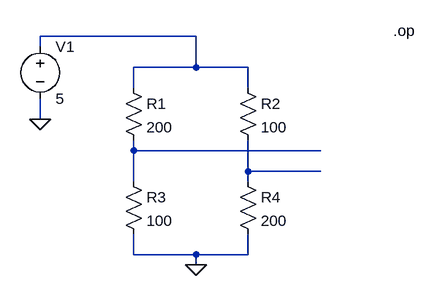
[diagram p0: schematic Draft2.asc]
Draft2.asc, the LTspice schematic file:
Version 4
SHEET 1 880 680
WIRE 288 144 48 144
WIRE 48 160 48 144
WIRE 288 192 288 144
WIRE 288 192 192 192
WIRE 368 192 288 192
WIRE 192 224 192 192
WIRE 368 224 368 192
WIRE 48 272 48 240
WIRE 192 320 192 304
WIRE 480 320 192 320
WIRE 368 352 368 304
WIRE 480 352 368 352
WIRE 192 368 192 320
WIRE 368 368 368 352
WIRE 192 480 192 448
WIRE 288 480 192 480
WIRE 368 480 368 448
WIRE 368 480 288 480
WIRE 288 496 288 480
FLAG 288 496 0
FLAG 48 272 0
SYMBOL res 176 208 R0
SYMATTR InstName R1
SYMATTR Value 200
SYMBOL res 352 208 R0
SYMATTR InstName R2
SYMATTR Value 100
SYMBOL res 176 352 R0
SYMATTR InstName R3
SYMATTR Value 100
SYMBOL res 352 352 R0
SYMATTR InstName R4
SYMATTR Value 200
SYMBOL voltage 48 144 R0
SYMATTR InstName V1
SYMATTR Value 5
TEXT 592 136 Left 2 !.op

The netlist it stands for:
* Draft2.asc
R1 N001 N002 200
R2 N001 N003 100
R3 N002 0 100
R4 N003 0 200
V1 N001 0 5
.op
.backanno
.end